# Altium schematic sheet stm32h750ibk6.SchDoc: MCU
size A4; Date: 02.10.2025; CheckedBy: BCY; DrawnBy: miaow; DocumentNumber: 5; Revision: v0.0.1; SheetNumber: 5; SheetTotal: 7; Sample: A0; Url: github.com/miaow-cn/pcb-lib; Liscense: GPLv3; Board: MIAOW FOC BOARD; BoardType: MAIN_PCB; Desc: stm32h750ibk6
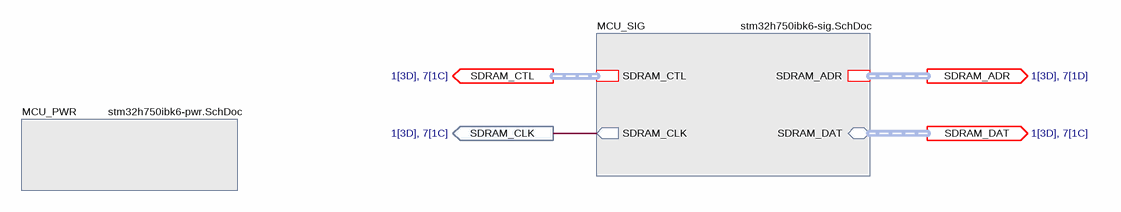
[diagram p0: stm32h750ibk6.SchDoc]

## Sub-sheets
MCU_PWR = stm32h750ibk6-pwr.SchDoc: no entries
MCU_SIG = stm32h750ibk6-sig.SchDoc: SDRAM_ADR (harness SDRAM_ADR), SDRAM_CTL (harness SDRAM_CTL), SDRAM_CLK (out), SDRAM_DAT (bidir, harness SDRAM_DAT)

## Ports
SDRAM_ADR (out, harness SDRAM_ADR, see 1[3D], 7[1D]), SDRAM_CLK (out, see 1[3D], 7[1C]), SDRAM_CTL (out, harness SDRAM_CTL, see 1[3D], 7[1C]), SDRAM_DAT (out, harness SDRAM_DAT, see 1[3D], 7[1C])

## Nets
SDRAM_CLK: port SDRAM_CLK, sheet MCU_SIG/SDRAM_CLK

## Buses and harness runs
harness port SDRAM_ADR = sheet MCU_SIG/SDRAM_ADR
harness port SDRAM_CTL = sheet MCU_SIG/SDRAM_CTL
harness port SDRAM_DAT = sheet MCU_SIG/SDRAM_DAT

## Notes on the sheet
- DRAWN
- CHECKED
- DRAWNBY
- SHEETS
- SHEETS_NO